# Altium schematic sheet block diagram.schdoc
size A4
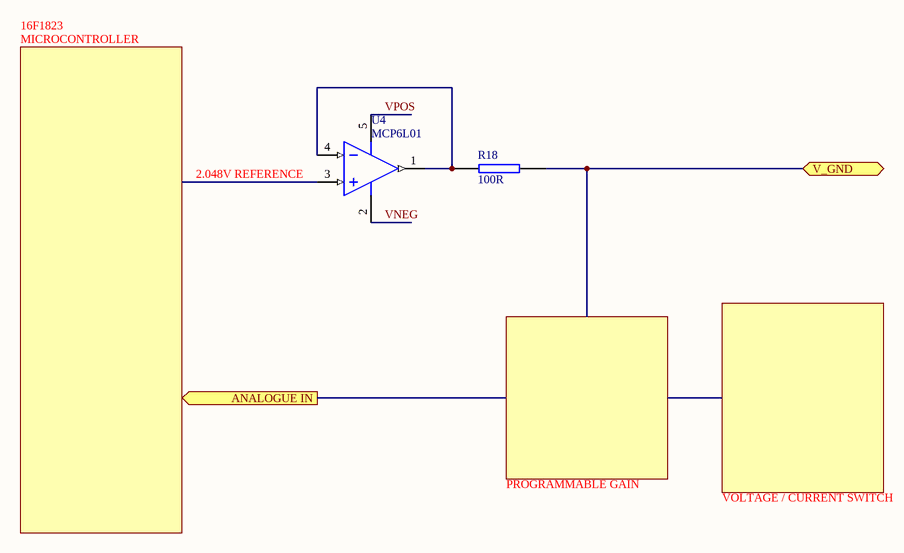
[diagram p0: block diagram.schdoc]

## Parts
R18  100R  [RES (3D) - 0603]
U4  MCP6L01  [SOT23-5AL]

## Ports
ANALOGUE IN (out), V_GND (bidir)

## Nets
V_GND: R18.2 ; port V_GND
VNEG: U4.2(GND)
VPOS: U4.5(V+)
NetR18_1: R18.1 U4.1(OUTA) U4.4(INA-)

Not connected (* = marked no-connect by the designer): U4 3(INA+)

## Notes on the sheet
- 16F1823
- MICROCONTROLLER
- (near U4) 2.048V REFERENCE
- PROGRAMMABLE GAIN
- VOLTAGE / CURRENT SWITCH

## Library data of the parts
R18 = RES SMD 0603: RESISTOR SMD 0603; value: 100R
U4 = MCP6L01: Value: MCP6L01